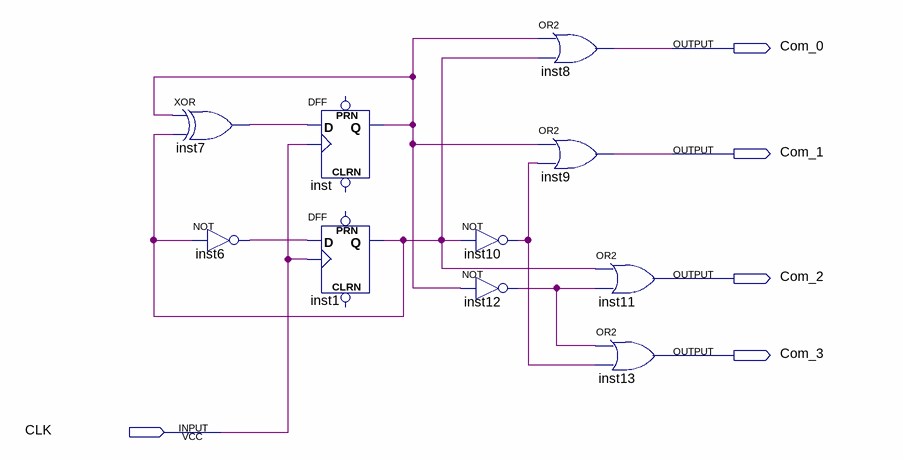
[diagram p0: schematic sheet]
// Quartus schematic FNDArraycontrol.bdf as structural Verilog: 10 symbols, 5 pins
module FNDArraycontrol (
  input  CLK,
  output Com_0,
  output Com_1,
  output Com_2,
  output Com_3
);

  wire inst1_q, inst6_out, inst7_out, inst10_out, inst12_out, inst_q;

  xor inst7 (inst7_out, inst_q, inst1_q);
  not inst6 (inst6_out, inst1_q);
  DFF inst (.CLK(CLK), .D(inst7_out), .Q(inst_q));  // open: CLRN, PRN
  DFF inst1 (.CLK(CLK), .D(inst6_out), .Q(inst1_q));  // open: CLRN, PRN
  not inst10 (inst10_out, inst1_q);
  not inst12 (inst12_out, inst_q);
  or inst8 (Com_0, inst_q, inst1_q);
  or inst9 (Com_1, inst_q, inst10_out);
  or inst11 (Com_2, inst1_q, inst12_out);
  or inst13 (Com_3, inst12_out, inst10_out);
endmodule
